# Altium project Gymbal.PrjPcb
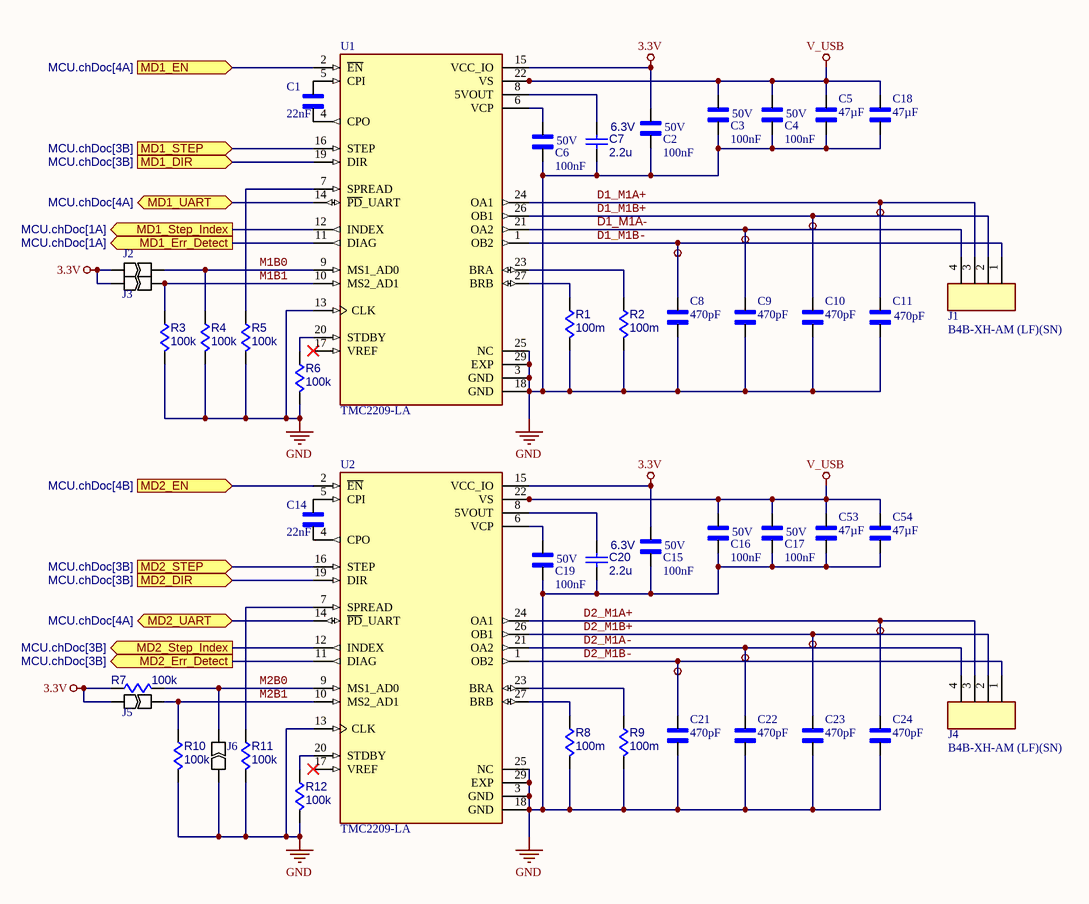
[diagram p0: Motordrivers.SchDoc]
Engineer: Gabriel Ohnstad
4 sheets, 119 parts. Net scope: flat (ports and power ports of the same name join across sheets).
Board file: PCB1.PcbDoc
Sheets:
  Motordrivers.SchDoc
  PowerRails.SchDoc
  Digital_IO.SchDoc
  MCU.chDoc.SchDoc

## Sheet Motordrivers.SchDoc
size A4; Revision: 0; SheetNumber: 1; SheetTotal: 4

### Parts
C1  value 22nF  [CAPC1005X55N]  (hidden comment: C0402C223K5REC7411)
C2  value 100nF  Voltage Rating: 50V  [CAPC1608X90N]  (hidden comment: GCM188L81H104KA57D)
C3  value 100nF  Voltage Rating: 50V  [CAPC1608X90N]  (hidden comment: GCM188L81H104KA57D)
C4  value 100nF  Voltage Rating: 50V  [CAPC1608X90N]  (hidden comment: GCM188L81H104KA57D)
C5  value 47µF  [CAPC3225X270N]  (hidden comment: GRM32ER61C476KE15L)
C6  value 100nF  Voltage Rating: 50V  [CAPC1608X90N]  (hidden comment: GCM188L81H104KA57D)
C7  value 2.2u  Voltage Rating: 6.3V  [CAPC0603(1608)100_L]  (hidden comment: Capacitors,2.2u,6.3V)
C8  value 470pF  [CAPC1608X90N]  (hidden comment: GRM1885C2A471JA01D)
C9  value 470pF  [CAPC1608X90N]  (hidden comment: GRM1885C2A471JA01D)
C10  value 470pF  [CAPC1608X90N]  (hidden comment: GRM1885C2A471JA01D)
C11  value 470pF  [CAPC1608X90N]  (hidden comment: GRM1885C2A471JA01D)
C14  value 22nF  [CAPC1005X55N]  (hidden comment: C0402C223K5REC7411)
C15  value 100nF  Voltage Rating: 50V  [CAPC1608X90N]  (hidden comment: GCM188L81H104KA57D)
C16  value 100nF  Voltage Rating: 50V  [CAPC1608X90N]  (hidden comment: GCM188L81H104KA57D)
C17  value 100nF  Voltage Rating: 50V  [CAPC1608X90N]  (hidden comment: GCM188L81H104KA57D)
C18  value 47µF  [CAPC3225X270N]  (hidden comment: GRM32ER61C476KE15L)
C19  value 100nF  Voltage Rating: 50V  [CAPC1608X90N]  (hidden comment: GCM188L81H104KA57D)
C20  value 2.2u  Voltage Rating: 6.3V  [CAPC0603(1608)100_L]  (hidden comment: Capacitors,2.2u,6.3V)
C21  value 470pF  [CAPC1608X90N]  (hidden comment: GRM1885C2A471JA01D)
C22  value 470pF  [CAPC1608X90N]  (hidden comment: GRM1885C2A471JA01D)
C23  value 470pF  [CAPC1608X90N]  (hidden comment: GRM1885C2A471JA01D)
C24  value 470pF  [CAPC1608X90N]  (hidden comment: GRM1885C2A471JA01D)
C53  value 47µF  [CAPC3225X270N]  (hidden comment: GRM32ER61C476KE15L)
C54  value 47µF  [CAPC3225X270N]  (hidden comment: GRM32ER61C476KE15L)
J1  B4B-XH-AM (LF)(SN)  [FP-B4B-XH-AM_LF_SN-MFG]
J2  JUMPER  [JUMPER]  (value not drawn)
J3  JUMPER  [JUMPER]  (value not drawn)
J4  B4B-XH-AM (LF)(SN)  [FP-B4B-XH-AM_LF_SN-MFG]
J5  JUMPER  [JUMPER]  (value not drawn)
J6  JUMPER  [JUMPER]  (value not drawn)
R1  value 100m  [RESC0402(1005)_L]  (hidden comment: Resistors,0402,1%,100m)
R2  value 100m  [RESC0402(1005)_L]  (hidden comment: Resistors,0402,1%,100m)
R3  value 100k  [RESC0402(1005)_L]  (hidden comment: Resistors,0402,100k)
R4  value 100k  [RESC0402(1005)_L]  (hidden comment: Resistors,0402,100k)
R5  value 100k  [RESC0402(1005)_L]  (hidden comment: Resistors,0402,100k)
R6  value 100k  [RESC0402(1005)_L]  (hidden comment: Resistors,0402,100k)
R7  value 100k  [RESC0402(1005)_L]  (hidden comment: Resistors,0402,100k)
R8  value 100m  [RESC0402(1005)_L]  (hidden comment: Resistors,0402,1%,100m)
R9  value 100m  [RESC0402(1005)_L]  (hidden comment: Resistors,0402,1%,100m)
R10  value 100k  [RESC0402(1005)_L]  (hidden comment: Resistors,0402,100k)
R11  value 100k  [RESC0402(1005)_L]  (hidden comment: Resistors,0402,100k)
R12  value 100k  [RESC0402(1005)_L]  (hidden comment: Resistors,0402,100k)
U1  TMC2209-LA  [QFN50P500X500X90-29N]
U2  TMC2209-LA  [QFN50P500X500X90-29N]

### Ports
MD1_DIR (in, see MCU.chDoc[3B]), MD1_EN (in, see MCU.chDoc[4A]), MD1_Err_Detect (out, see MCU.chDoc[1A]), MD1_STEP (in, see MCU.chDoc[3B]), MD1_Step_Index (out, see MCU.chDoc[1A]), MD1_UART (bidir, see MCU.chDoc[4A]), MD2_DIR (in, see MCU.chDoc[3B]), MD2_EN (in, see MCU.chDoc[4B]), MD2_Err_Detect (out, see MCU.chDoc[3B]), MD2_STEP (in, see MCU.chDoc[3B]), MD2_Step_Index (out, see MCU.chDoc[3B]), MD2_UART (bidir, see MCU.chDoc[4A])

### Nets
3.3V: C2.1 C15.1 J2.1 J3.1 J5.1 R7.1 U1.15(VCC_IO) U2.15(VCC_IO)
D1_M1A+: C11.2 J1.3 U1.24(OA1)
D1_M1A-: C9.2 J1.4 U1.21(OA2)
D1_M1B+: C10.2 J1.2 U1.26(OB1)
D1_M1B-: C8.2 J1.1 U1.1(OB2)
D2_M1A+: C24.2 J4.3 U2.24(OA1)
D2_M1A-: C22.2 J4.4 U2.21(OA2)
D2_M1B+: C23.2 J4.2 U2.26(OB1)
D2_M1B-: C21.2 J4.1 U2.1(OB2)
GND: C2.2 C3.2 C4.2 C5.2 C6.2 C7.2 C8.1 C9.1 C10.1 C11.1 C15.2 C16.2 C17.2 C18.2 C19.2 C20.2 C21.1 C22.1 C23.1 C24.1 C53.2 C54.2 J6.1 R1.2 R2.2 R3.2 R4.2 R5.2 R6.2 R8.2 R9.2 R10.2 R11.2 R12.2 U1.3(GND) U1.13(CLK) U1.18(GND) U1.25(NC) U1.29(EXP) U2.3(GND) U2.13(CLK) U2.18(GND) U2.25(NC) U2.29(EXP)
V_USB: C3.1 C4.1 C5.1 C16.1 C17.1 C18.1 C53.1 C54.1 U1.22(VS) U1.28(VS) U2.22(VS) U2.28(VS)
DRIVER_EN: U1.2(~{EN}) U2.2(~{EN}) ; port MD1_EN, port MD2_EN
M1B0: J2.2 R4.1 U1.9(MS1_AD0)
M1B1: J3.2 R3.1 U1.10(MS2_AD1)
M2B0: J6.2 R7.2 U2.9(MS1_AD0)
M2B1: J5.2 R10.1 U2.10(MS2_AD1)
MD1_DIR: U1.16(STEP) ; port MD1_STEP
MD1_ERR_Detect: U1.11(DIAG) ; port MD1_Err_Detect
MD1_STEP: U1.19(DIR) ; port MD1_DIR
MD1_STEP_Index: U1.12(INDEX) ; port MD1_Step_Index
MD2_DIR: U2.19(DIR) ; port MD2_DIR
MD2_ERR_Detect: U2.11(DIAG) ; port MD2_Err_Detect
MD2_STEP: U2.16(STEP) ; port MD2_STEP
MD2_STEP_Index: U2.12(INDEX) ; port MD2_Step_Index
MD_UART: U1.14(~{PD}_UART) U2.14(~{PD}_UART) ; port MD1_UART, port MD2_UART
NetC1_1: C1.1 U1.4(CPO)
NetC1_2: C1.2 U1.5(CPI)
NetC6_1: C6.1 U1.6(VCP)
NetC7_1: C7.1 U1.8(5VOUT)
NetC14_1: C14.1 U2.4(CPO)
NetC14_2: C14.2 U2.5(CPI)
NetC19_1: C19.1 U2.6(VCP)
NetC20_1: C20.1 U2.8(5VOUT)
NetR1_1: R1.1 U1.27(BRB)
NetR2_1: R2.1 U1.23(BRA)
NetR5_1: R5.1 U1.7(SPREAD)
NetR6_1: R6.1 U1.20(STDBY)
NetR8_1: R8.1 U2.27(BRB)
NetR9_1: R9.1 U2.23(BRA)
NetR11_1: R11.1 U2.7(SPREAD)
NetR12_1: R12.1 U2.20(STDBY)

Not connected (* = marked no-connect by the designer): U1 17(VREF)*; U2 17(VREF)*

### Notes on the sheet
- Title
- Engineer
- Size:
- Date:
- A4
- Number:
- Time:
- Revision:
- Sheet
- of
- File:

### Library data of the parts
C1 C14 = CMP-001-00084-1: 0.022 ÂµF Â±10% 50V Ceramic Capacitor X7R 0402 (1005 Metric); MF: KEMET; Case/Package: 1005 KEMET; Pins: 2; Component Type: Standard; Source: C0402C223K5REC7411.SchLib; SnapEDA_Link: https://www.snapeda.com/parts/C0402C223K5REC7411/KEMET/view-part/?ref=snap; MP: C0402C223K5REC7411; Design Item ID: C0402C223K5REC7411; Check_prices: https://www.snapeda.com/parts/C0402C223K5REC7411/KEMET/view-part/?ref=eda
C2-C4 C6 C15-C17 C19 = CMP-001-00085-1: SMD capacitor X8L(MURATA) with capacitance 0.10uF Tol.10%. Rated voltage 50Vdc 150C; MF: Murata Electronics; Pins: 2; Component Type: Standard; Check_prices: https://www.snapeda.com/parts/GCM188L81H104KA57D/Murata+Electronics+North+America/view-part/?ref=eda; Source: GCM188L81H104KA57D.SchLib; MP: GCM188L81H104KA57D; Design Item ID: GCM188L81H104KA57D; SnapEDA_Link: https://www.snapeda.com/parts/GCM188L81H104KA57D/Murata+Electronics+North+America/view-part/?ref=snap
C5 C18 C53 C54 = CMP-001-00087-1: SMD Capacitor X5R(EIA) with Capacitance: 47uF Tol. 10%. Rated Voltage: 16Vdc; MF: Murata Electronics; Case/Package: 3225 Murata; Pins: 2; Component Type: Standard; Source: GRM32ER61C476KE15L.SchLib; SnapEDA_Link: https://www.snapeda.com/parts/GRM32ER61C476KE15L/Murata+Electronics+North+America/view-part/?ref=snap; Design Item ID: GRM32ER61C476KE15L; MP: GRM32ER61C476KE15L; Check_prices: https://www.snapeda.com/parts/GRM32ER61C476KE15L/Murata+Electronics+North+America/view-part/?ref=eda
C7 C20 = Capacitors: Capacitor, Decoupling; Component Type: Capacitors
C8-C11 C21-C24 = CMP-001-00083-1: SMD Capacitor C0G(EIA) with Capacitance: 470pF Tol. 5%. Rated Voltage: 100Vdc; MF: Murata Electronics; Case/Package: 1608 Murata; Pins: 2; Component Type: Standard; Source: GRM1885C2A471JA01D.SchLib; MP: GRM1885C2A471JA01D; SnapEDA_Link: https://www.snapeda.com/parts/GRM1885C2A471JA01D/Murata+Electronics+North+America/view-part/?ref=snap; Check_prices: https://www.snapeda.com/parts/GRM1885C2A471JA01D/Murata+Electronics+North+America/view-part/?ref=eda; Design Item ID: GRM1885C2A471JA01D
J1 J4 = CMP-002-00073-1: CONN HEADER VERT 4POS 2.5MM / Connector Header Through Hole 4 position 0.098" (2.50mm); Number of Positions: 4; Connector Type: Male Pin; Pitch: 2.4892mm; Insulation Resistance: 1GΩ; Contact Resistance: 20mΩ; Ratings: TUV; Current Rating: 3A; Gender: Male; Voltage Rating: 250V; Termination: Solder; Orientation: Straight; Mounting Technology: Through Hole; Min Operating Temperature: -25°C; Terminal Pitch: 2.5mm; Housing Material: Polyamide; Max Operating Temperature: 85°C; Depth: 5.75mm; Lead Free: Lead Free; Length: 12.4mm; Harmonized Tariff Schedule (HTS) Code: 8536.69.40.40; Housing Color: White; RoHS: Compliant; Fastening Type: Detent; Color: Green; Introduction Date: 2010-11-30; Packaging: Box; Contact Material: Brass; Number of Contacts: 4; Export Control Classification Number (ECCN) Code: EAR99; Height: 7mm; Contact Plating: Tin; Insulation Color: White; Max Current Rating: 3A; Lifecycle Status: Production; Pins: 4; Max Voltage Rating (AC): 250V; Number of Rows: 1; REACH SVHC: Yes
J2 J3 J5 J6 = CMP-009-00061-10: Pins: 2
R1 R2 R8 R9 = Resistors: Resistor; Case/Package: 0402; Tolerance: 1%; Component Type: Resistors
R3-R7 R10-R12 = Resistors: Resistor, Bootstrap; Case/Package: 0402; Component Type: Resistors
U1 U2 = CMP-010-000001-7: Bipolar Motor Driver Power MOSFET Step/Direction, UART 28-QFN (5x5); MF: Maxim Integrated Products; MP: TMC2209-LA; Design Item ID: TMC2209-LA; Value: *; Pin Count: 29; Component Type: Standard; SnapEDA_Link: https://www.snapeda.com/parts/TMC2209-LA/Maxim+Integrated/view-part/?ref=snap; Package: None; Check_prices: https://www.snapeda.com/parts/TMC2209-LA/Maxim+Integrated/view-part/?ref=eda; Source: TMC2209-LA.SchLib

## Sheet PowerRails.SchDoc
size A4; SheetNumber: 2; SheetTotal: 4
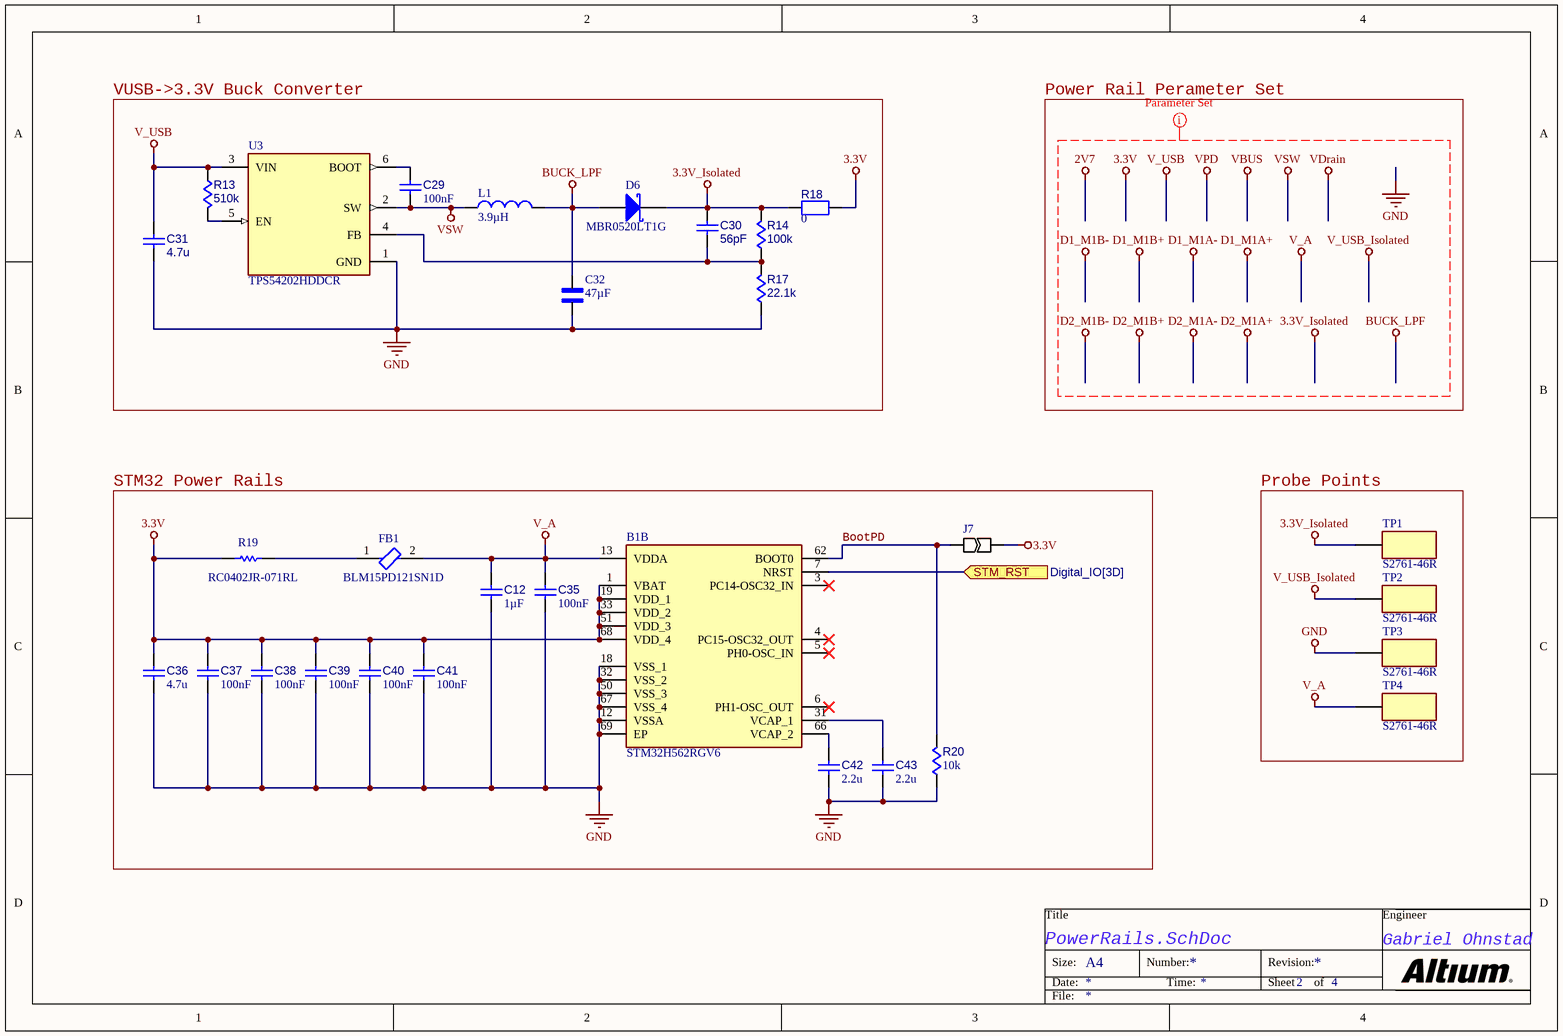
[diagram p1: PowerRails.SchDoc]

### Parts
B1  STM32H562RGV6  [QFN40P800X800X100-69N-D]  (part B of 2)
C12  value 1µF  [CAPC1608X94X35NL15T15]  (hidden comment: Capacitor 1 uF +/- 10% 16 V 0603)
C29  value 100nF  [CAPC0402(1005)60_L]  (hidden comment: Capacitor 100nF +/-20% 25V 0402)
C30  value 56pF  [CAPC0402(1005)60_L]  (hidden comment: Capacitors,ceramic,0402,5%,56pF)
C31  value 4.7u  [CAPC0805(2012)145_L]  (hidden comment: Capacitors,0805,4.7u)
C32  value 47µF  [CAPC3225X270N]  (hidden comment: GRM32ER61C476KE15L)
C35  value 100nF  [CAPC0402(1005)60_L]  (hidden comment: Capacitor 100nF +/-20% 25V 0402)
C36  value 4.7u  [CAPC0805(2012)145_L]  (hidden comment: Capacitors,0805,4.7u)
C37  value 100nF  [CAPC0402(1005)60_L]  (hidden comment: Capacitor 100nF +/-20% 25V 0402)
C38  value 100nF  [CAPC0402(1005)60_L]  (hidden comment: Capacitor 100nF +/-20% 25V 0402)
C39  value 100nF  [CAPC0402(1005)60_L]  (hidden comment: Capacitor 100nF +/-20% 25V 0402)
C40  value 100nF  [CAPC0402(1005)60_L]  (hidden comment: Capacitor 100nF +/-20% 25V 0402)
C41  value 100nF  [CAPC0402(1005)60_L]  (hidden comment: Capacitor 100nF +/-20% 25V 0402)
C42  value 2.2u  [CAPC0805(2012)145_L]  (hidden comment: Capacitors,0805,2.2u)
C43  value 2.2u  [CAPC0805(2012)145_L]  (hidden comment: Capacitors,0805,2.2u)
D6  MBR0520LT1G  [ONSC-SOD-123-2-425-04_V]
FB1  BLM15PD121SN1D  [FP-BLM15-0_05-IPC_B]
J7  JUMPER  [JUMPER]  (value not drawn)
L1  value 3.9µH  [SRR5018-3R9Y-Footprint-1]  (hidden comment: SRR5018-3R9Y)
R13  value 510k  [RESC0402(1005)_L]  (hidden comment: Resistors,0402,510k)
R14  value 100k  [RESC0402(1005)_L]  (hidden comment: Resistors,0402,100k)
R17  value 22.1k  [RESC0402(1005)_L]  (hidden comment: Resistors,0402,22.1k)
R18  value 0  [RESC0805(2012)_L]  (hidden comment: HCJ0805ZT0R00)
R19  RC0402JR-071RL  [RESC1005X40X25LL05T10]
R20  value 10k  [RESC0402(1005)_L]  (hidden comment: Resistors,0402,10k)
TP1  S2761-46R  [HARWIN_S2761-46R]
TP2  S2761-46R  [HARWIN_S2761-46R]
TP3  S2761-46R  [HARWIN_S2761-46R]
TP4  S2761-46R  [HARWIN_S2761-46R]
U3  TPS54202HDDCR  [FP-DDC0006A-IPC_C]

### Blocks framed on the sheet
VUSB->3.3V Buck Converter: C29-C32 D6 L1 R13 R14 R17 R18 U3
STM32 Power Rails: B1 C12 C35-C43 FB1 J7 R19 R20
Probe Points: TP1-TP4

### Ports
STM_RST (in, see Digital_IO[3D])

### Nets
3.3V: B1.1(VBAT) B1.19(VDD_1) B1.33(VDD_2) B1.51(VDD_3) B1.68(VDD_4) C36.2 C37.1 C38.1 C39.1 C40.1 C41.1 J7.2 R18.1 R19.1
3.3V_Isolated: C30.2 D6.2(K) R14.2 R18.2 TP1.1
BUCK_LPF: C32.1 D6.1(A) L1.2
GND: B1.12(VSSA) B1.18(VSS_1) B1.32(VSS_2) B1.50(VSS_3) B1.67(VSS_4) B1.69(EP) C12.1 C31.1 C32.2 C35.2 C36.1 C37.2 C38.2 C39.2 C40.2 C41.2 C42.1 C43.1 R17.1 R20.1 TP3.1 U3.1(GND)
V_A: B1.13(VDDA) C12.2 C35.1 FB1.2 TP4.1
V_USB: C31.2 R13.1 U3.3(VIN)
V_USB_Isolated: TP2.1
VSW: C29.1 L1.1 U3.2(SW)
BootPD: B1.62(BOOT0) J7.1 R20.2
NetB1_7: B1.7(NRST) ; port STM_RST
NetB1_31: B1.31(VCAP_1) C43.2
NetB1_66: B1.66(VCAP_2) C42.2
NetC29_2: C29.2 U3.6(BOOT)
NetC30_1: C30.1 R14.1 R17.2 U3.4(FB)
NetFB1_1: FB1.1 R19.2
NetR13_2: R13.2 U3.5(EN)

Not connected (* = marked no-connect by the designer): B1 3(PC14-OSC32_IN)* 4(PC15-OSC32_OUT)* 5(PH0-OSC_IN)* 6(PH1-OSC_OUT)*

### Notes on the sheet
- Power Rail Perameter Set
- Title
- Engineer
- Size:
- Date:
- A4
- Number:
- Time:
- Revision:
- Sheet
- of
- File:

### Library data of the parts
B1 = CMP-004-000001-1: MCU 32-bit ARM Cortex M33 RISC 1MB Flash 1.8V/2.5V/3.3V 68-Pin VFQFPN EP Tray; Manufacturer_Name: STMicroelectronics; Geometry.Height: 1mm; Core Architecture: ARM Cortex-M33; Datasheet Link: https://www.st.com/resource/en/datasheet/stm32h562ag.pdf; Mouser Price/Stock: https://www.mouser.co.uk/ProductDetail/STMicroelectronics/STM32H563RGV6?qs=Jm2GQyTW%2FbjkEO3Um3%252BxKg%3D%3D; Mouser Part Number: 511-STM32H563RGV6; Design Item ID: STM32H563RGV6; Manufacturer_Part_Number: STM32H563RGV6; Source: STM32H563RGV6.SchLib; Memory Format: FLASH; REACH SVHC: Yes; Lifecycle Status: Production; Pins: 68; China RoHS: Compliant; RoHS: Compliant
C12 = CMP-001-00003-9: Chip Capacitor, 1 uF, +/- 10%, 16 V, 0603 (1608 Metric); Voltage Rating: 16V; Capacitor Type: Ceramic; RoHS Compliant: True; Case/Package: 0603; Tolerance: 10%; Mounting Technology: SM; Pins: 2; Min Operating Temperature: -55°C; Max Operating Temperature: 125°C
C29 C35 C37-C41 = CMP-001-00065-7: Chip Capacitor, 100nF +/-20%, 25V, 0402, Thickness 0.6 mm; Tolerance: 10%; Mounting Technology: SMT; Case/Package: 0402; Pins: 2; Min Operating Temperature: -55°C; Max Operating Temperature: 85°C; Voltage Rating: 25V
C30 = Capacitors: Capacitor, Filter; Case/Package: 0402; Capacitor Type: ceramic; Tolerance: 5%; Component Type: Capacitors
C31 C36 = Capacitors: Capacitor, Decoupling; Case/Package: 0805; Component Type: Capacitors
C32 = CMP-001-00087-1: as C5 on sheet Motordrivers; Case/Package: 3225 Murata; Pins: 2; Component Type: Standard; Source: GRM32ER61C476KE15L.SchLib; SnapEDA_Link: https://www.snapeda.com/parts/GRM32ER61C476KE15L/Murata+Electronics+North+America/view-part/?ref=snap; Design Item ID: GRM32ER61C476KE15L; MP: GRM32ER61C476KE15L; Check_prices: https://www.snapeda.com/parts/GRM32ER61C476KE15L/Murata+Electronics+North+America/view-part/?ref=eda
C42 C43 = Capacitors: Capacitor, Charge Pump; Case/Package: 0805; Component Type: Capacitors
D6 = CMP-004-00003-2: Schottky Power Rectifier, 20 V, 5.5 A, -65 to 125 degC, 2-Pin SMD, RoHS, Tape and Reel; Manufacturer: ON Semiconductor; Forward Current: 500mA; Peak Reverse Current: 250uA; Elements: 1; Forward Voltage: 385mV; Max Surge Current: 5.5A; Max Operating Temperature: 125°C; Min Operating Temperature: -65°C; Mounting Technology: SM; Datasheet URL: http://www.onsemi.cn/pub_link/Collateral/MBR0520LT1-D.PDF; RoHS Compliant: True; Pins: 2; Package Quantity: 3000; Case/Package: SOD; Package Reference: SOD-123-2-425-04; Package Description: 2-Pin Surface Mount Device, Body 2.69 x 1.6 mm; Packaging: TapeandReel; Manufacturer URL: http://www.onsemi.com/; Datasheet Version: Rev. 6, 01/2012
FB1 = CMP-0686-00281-4: Chip Ferrite Bead, 0402, 120Ω @ 100MHz, 0.09Ω, 25%, 1.3A; Impedance: 120R; Material: Steel; Number of Lines: 1; DC Resistance (DCR): 90mR; Number of Pins: 2; Military Standard: Not; Width: 0.5mm; Depth: 0.55mm; Lead Free: Lead Free; Test Frequency: 100MHz; Case Code (Metric): 1005; Case Code (Imperial): 0402; Current Rating: 1.3A; Package Quantity: 1; Height: 0.5mm; Radiation Hardening: No; Tolerance: 25%; Max DC Current: 1.3A; Packaging: Tape and Reel; REACH SVHC: No SVHC; Case/Package: 0402; Min Operating Temperature: -55°C; Max Current Rating: 1.3A; Length: 1mm; Number of Circuits: 1; Core Material: Ferrite; Max Operating Temperature: 125°C; Termination: SMD/SMT; DC Current: 1.3A
J7 = CMP-009-00061-10: Pins: 2
L1 = CMP-006-00022-2: Inductor Power Shielded Wirewound 3.9uH 30% 100KHz 8Q-Factor Ferrite 2A 0.055Ohm DCR T/R; DC Resistance (DCR): 55mΩ; Max Current Rating: 2.1A; Self Resonant Frequency: 64MHz; Q Factor: 8; Number of Circuits: 1; Harmonized Tariff Schedule (HTS) Code: 8504.50.80.00; Schedule B: 8504500000, 8504500000; Case Code (Imperial): 2323; Lifecycle Status: Production; Number of Terminals: 2; Height - Seated (Max): 1.8034mm; Termination: SMD/SMT; RoHS: Compliant; Depth: 6.1mm; Max DC Current: 2A; Tolerance: 30%; Min Operating Temperature: -40°C; Country of Origin: Mainland China; Export Control Classification Number (ECCN) Code: EAR99; Composition: Wirewound; Max Operating Temperature: 125°C; Military Standard: Not; Packaging: Tape and Reel; Test Frequency: 100kHz; Case Code (Metric): 5858; Introduction Date: 2007-08-29; Width: 5.8mm; Core Material: Ferrite; Shielding: Shielded; DC Current: 2A; Current Rating: 2A; Mounting Technology: Surface Mount; China RoHS: Compliant; Case/Package: 2323; Saturation Current: 2.1A; REACH SVHC: Yes; Length: 5.8mm; Height: 1.8mm
R13 R20 = Resistors: Resistor, Bootstrap; Case/Package: 0402; Component Type: Resistors
R14 R17 = Resistors: Resistor; Case/Package: 0402; Component Type: Resistors
R18 = CMP-009-00179-2: HCJ Series 0805 Jumper Surface Mount Chip Resistor; Manufacturer Package Identifier: 0805 (2012 metric); Power Rating: 500mW; DNP: TRUE; Mounting Technology: Surface Mount; Case/Package: 0805; Min Operating Temperature: -55°C; Max Operating Temperature: 155°C; Number of Terminals: 2; Export Control Classification Number (ECCN) Code: EAR99; Ratings: AEC-Q200; Radiation Hardening: No; Width: 1.2mm; Number of Terminations: 2; Length: 2mm; REACH SVHC: Yes; Harmonized Tariff Schedule (HTS) Code: 8533.21.00.30; Introduction Date: 2013-09-03; Termination: Wraparound; Lead Free: Lead Free; Packaging: Cut Tape (CT); Case Code (Metric): 2012; RoHS: Compliant; Country of Origin: Taiwan; Lifecycle Status: Production; Schedule B: 8533210045, 8533210045; Case Code (Imperial): 0805; Height: 650µm; Composition: Metal Strip
R19 = CMP-2002-07953-1: Manufacturer: Yageo / Phycomp; Part Number: RC0402JR-071RL
TP1-TP4 = CMP-028-000000-3: MF: {'manufacturer': u'Harwin Inc.'}; Availability: Unavailable; Design Item ID: S2761-46R; MP: S2761-46R; Price: None; Pin Count: 1; Package: None; Component Type: Standard; Source: S2761-46R.SchLib; Value: *
U3 = CMP-019-00052-1: 4.5V to 28V Input, 2A Output, Synchronous Step-Down Voltage Converter 6-SOT-23-THIN -40 to 125; Manufacturer Lifecycle Status: ACTIVE; Quiescent Current: 40µA; Max Junction Temperature (Tj): 125°C; Topology: Buck; Nominal Supply Current: 45µA; Max Duty Cycle: 100%; Number of Outputs: 1; Switching Frequency: 500kHz; Max Supply Voltage: 28V; Length: 2.9mm; Lifecycle Status: Production; Max Operating Temperature: 125°C; Output Current: 2A; Thickness: 870µm; Pins: 6; RoHS: Compliant; Height: 1.1mm; Min Operating Temperature: -40°C; Width: 1.6mm; Lead Free: Lead Free; Min Supply Voltage: 4.5V; Schedule B: 8542390000, 8542390000

## Sheet Digital_IO.SchDoc
size A4; SheetNumber: 3; SheetTotal: 4
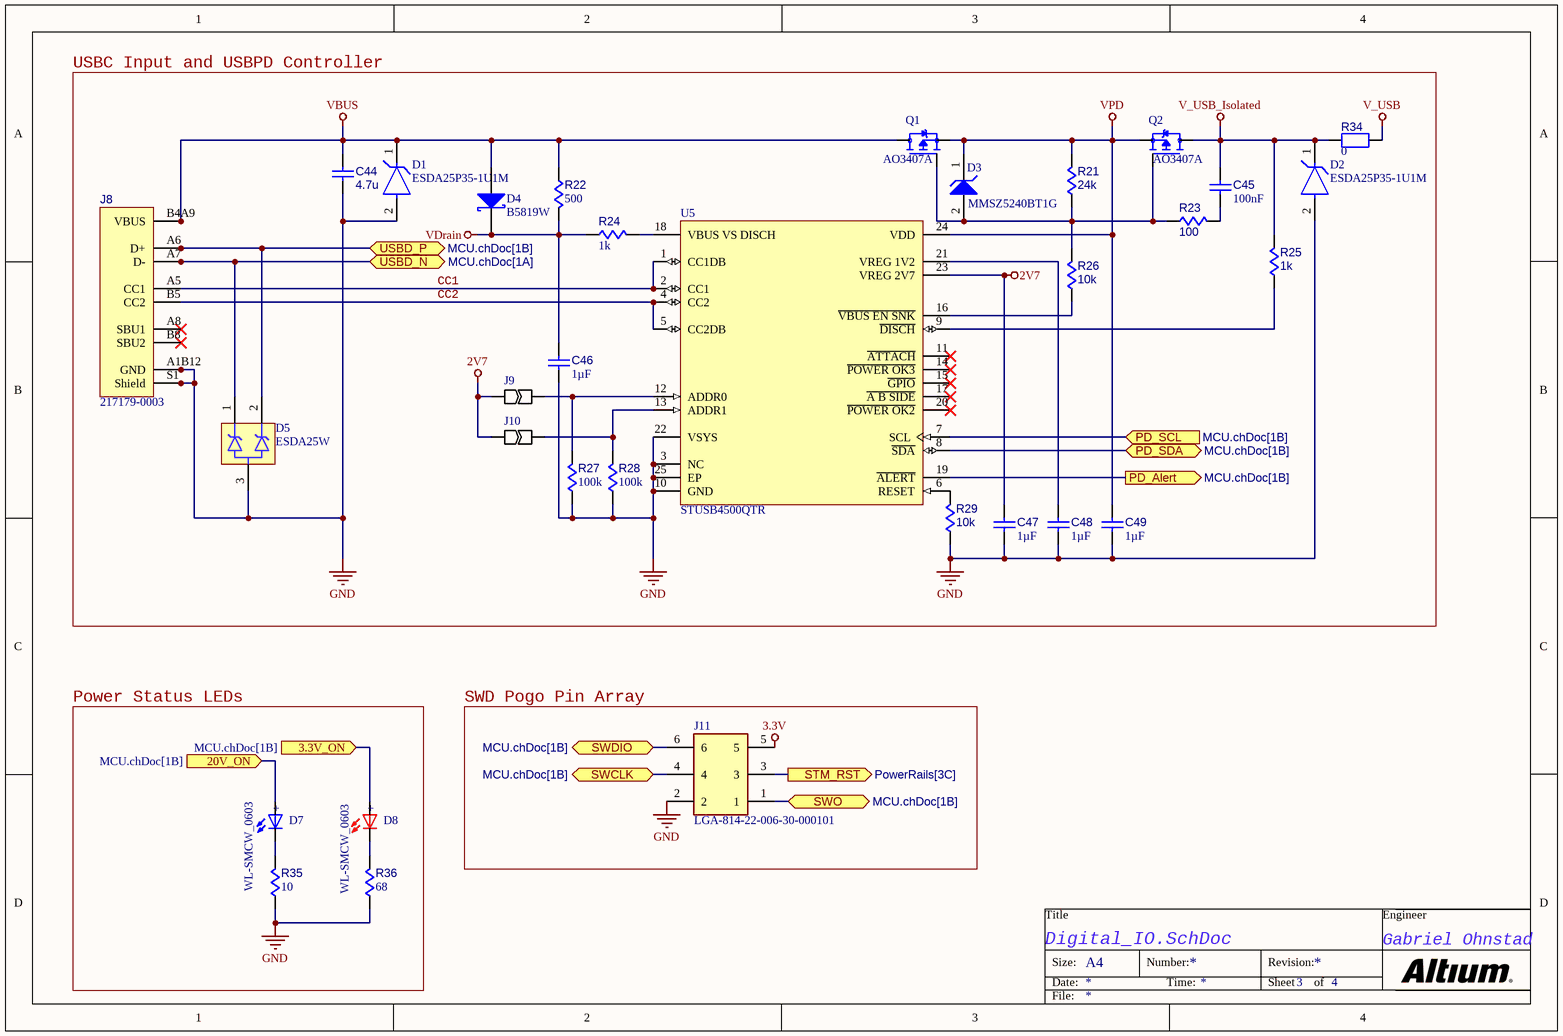
[diagram p2: Digital_IO.SchDoc]

### Parts
C44  value 4.7u  [CAPC0805(2012)145_L]  (hidden comment: Capacitors,0805,4.7u,50V)
C45  value 100nF  [CAPC0402(1005)60_L]  (hidden comment: Capacitor 100nF +/-20% 25V 0402)
C46  value 1µF  [CAPC2013X145X50ML20T25]  (hidden comment: Capacitor 1 uF +/- 10% 25 V 0805)
C47  value 1µF  [CAPC0402(1005)60_L]  (hidden comment: Capacitor 1µF +/-20% 10V 0402)
C48  value 1µF  [CAPC0402(1005)60_L]  (hidden comment: Capacitor 1µF +/-20% 10V 0402)
C49  value 1µF  [CAPC2013X145X50ML20T25]  (hidden comment: Capacitor 1 uF +/- 10% 25 V 0805)
D1  ESDA25P35-1U1M  [FP-QFN_1610-MFG]
D2  ESDA25P35-1U1M  [FP-QFN_1610-MFG]
D3  MMSZ5240BT1G  [ONSC-SOD-123-2-425-04_V]
D4  B5819W  [MCC-SOD123_V]
D5  ESDA25W  [FP-SOT323-3L-IPC_C]
D7  WL-SMCW_0603  [WL-SMCW_0603]
D8  WL-SMCW_0603  [WL-SMCW_0603]
J8  217179-0003  [217179-0003-Footprint-1]
J9  JUMPER  [JUMPER]  (value not drawn)
J10  JUMPER  [JUMPER]  (value not drawn)
J11  LGA-814-22-006-30-000101  [Alignment-8142200630000101]
Q1  AO3407A  [SOT95P280X125-3N]
Q2  AO3407A  [SOT95P280X125-3N]
R21  value 24k  [RESC0402(1005)_L]  (hidden comment: Resistors,0402,24k)
R22  value 500  [RESC0603(1608)_L]  (hidden comment: Resistors,0603,500)
R23  value 100  [RESC0402(1005)_L]  (hidden comment: Resistors,0402,100)
R24  value 1k  [RESC0603(1608)_L]  (hidden comment: Resistors,0603,1k)
R25  value 1k  [RESC0402(1005)_L]  (hidden comment: Resistors,0402,1k)
R26  value 10k  [RESC0402(1005)_L]  (hidden comment: Resistors,0402,10k)
R27  value 100k  [RESC0402(1005)_L]  (hidden comment: Resistors,0402,100k)
R28  value 100k  [RESC0402(1005)_L]  (hidden comment: Resistors,0402,100k)
R29  value 10k  [RESC0402(1005)_L]  (hidden comment: Resistors,0402,10k)
R34  value 0  [RESC0805(2012)_L]  (hidden comment: HCJ0805ZT0R00)
R35  value 10  [RESC0402(1005)_L]  (hidden comment: Resistors,0402,10)
R36  value 68  [RESC0402(1005)_L]  (hidden comment: Resistors,0402,68)
U5  STUSB4500QTR  [FP-QFN-24-EP_4x4-MFG]

### Blocks framed on the sheet
USBC Input and USBPD Controller: C44-C49 D1-D5 J8-J10 Q1 Q2 R21-R29 R34 U5
Power Status LEDs: D7 D8 R35 R36
SWD Pogo Pin Array: J11

### Ports
3.3V_ON (in, see MCU.chDoc[1B]), 20V_ON (in, see MCU.chDoc[1B]), PD_Alert (out, see MCU.chDoc[1B]), PD_SCL (in, see MCU.chDoc[1B]), PD_SDA (bidir, see MCU.chDoc[1B]), STM_RST (out, see PowerRails[3C]), SWCLK (bidir, see MCU.chDoc[1B]), SWDIO (bidir, see MCU.chDoc[1B]), SWO (bidir, see MCU.chDoc[1B]), USBD_N (bidir, see MCU.chDoc[1A]), USBD_P (bidir, see MCU.chDoc[1B])

### Nets
2V7: C47.2 J9.1 J10.1 U5.23(VREG_2V7)
3.3V: J11.5
GND: C44.1 C46.1 C47.1 C48.1 C49.1 D1.2(A) D2.2(A) D5.3(COMMON_ANODE) J8.A1B12(GND) J8.B1A12(GND) J8.S1(Shield) J8.S2(Shield) J8.S3(Shield) J8.S4(Shield) J11.2 R27.1 R28.1 R29.1 R35.1 R36.1 U5.3(NC) U5.10(GND) U5.22(VSYS) U5.25(EP)
V_USB: R34.1
V_USB_Isolated: C45.1 D2.1(C) Q2.3(D) R25.2 R34.2
VBUS: C44.2 D1.1(C) D4.1(A) J8.A4B9(VBUS) J8.B4A9(VBUS) Q1.3(D) R22.2
VDrain: C46.2 D4.2(K) R22.1 R24.2
VPD: C49.2 D3.1(K) Q1.2(S) Q2.2(S) R21.2 U5.24(VDD)
3.3V_ON: D8.2(POS) ; port 3.3V_ON
20V_ON: D7.2(POS) ; port 20V_ON
CC1: J8.A5(CC1) U5.1(CC1DB) U5.2(CC1)
CC2: J8.B5(CC2) U5.4(CC2) U5.5(CC2DB)
PD_Alert: U5.19(~{ALERT}) ; port PD_Alert
PD_SCL: U5.7(SCL) ; port PD_SCL
PD_SDA: U5.8(~{SDA}) ; port PD_SDA
SWCLK: J11.4 ; port SWCLK
SWDIO: J11.6 ; port SWDIO
SWO: J11.1 ; port SWO
USBD_N: D5.1(1_CATHODE) J8.A7(D-) J8.B7(D-) ; port USBD_N
USBD_P: D5.2(2_CATHODE) J8.A6(D+) J8.B6(D+) ; port USBD_P
NetB1_7: J11.3 ; port STM_RST
NetC45_2: C45.2 R23.2
NetC48_2: C48.2 U5.21(VREG_1V2)
NetD3_2: D3.2(A) Q1.1(G) Q2.1(G) R21.1 R23.1 R26.2
NetD7_1: D7.1(NEG) R35.2
NetD8_1: D8.1(NEG) R36.2
NetJ9_2: J9.2 R27.2 U5.12(ADDR0)
NetJ10_2: J10.2 R28.2 U5.13(ADDR1)
NetR24_1: R24.1 U5.18(VBUS_VS_DISCH)
NetR25_1: R25.1 U5.9(~{DISCH})
NetR26_1: R26.1 U5.16(~{VBUS_EN_SNK})
NetR29_2: R29.2 U5.6(RESET)

Not connected (* = marked no-connect by the designer): J8 A8(SBU1)* B8(SBU2)*; U5 11(~{ATTACH})* 14(~{POWER_OK3})* 15(~{GPIO})* 17(~{A_B_SIDE})* 20(~{POWER_OK2})*

### Notes on the sheet
- Title
- Engineer
- Size:
- Date:
- A4
- Number:
- Time:
- Revision:
- Sheet
- of
- File:
- (in symbol CMP-004-00035-2) +
- (in symbol CMP-004-00036-3) +

### Library data of the parts
C44 = Capacitors: Capacitor; Case/Package: 0805; Voltage Rating: 50V; Component Type: Capacitors
C45 = CMP-001-00065-7: as C29 on sheet PowerRails; Mounting Technology: SMT; Case/Package: 0402; Pins: 2; Min Operating Temperature: -55°C; Max Operating Temperature: 85°C; Voltage Rating: 25V
C46 C49 = CMP-001-00010-9: Chip Capacitor, 1 uF, +/-10%, 25 V, 0805 (2012 Metric); Capacitor Type: Ceramic; Voltage Rating: 25V; Mounting Technology: SM; Case/Package: 0805; Pins: 2; RoHS Compliant: True; Min Operating Temperature: -55°C; Max Operating Temperature: 125°C; Tolerance: 10%
C47 C48 = CMP-001-00063-6: Chip Capacitor, 1µF +/-20%, 10V, 0402, Thickness 0.6 mm; Tolerance: 10%; Pins: 2; Mounting Technology: SMT; Case/Package: 0402; Max Operating Temperature: 85°C; Voltage Rating: 10V; Min Operating Temperature: -55°C
D1 D2 = CMP-12225-000030-1: TVS DIODE 22V 41V 1610; Manufacturer: STMicroelectronics; Clamping Voltage: 39V; Breakdown Voltage: 23.3V; Max Junction Temp: +150°C; Peak Pulse Current: 35A; Number Of Channels: 1; Peak Pulse Power: 1400W; Standoff Height: 0.02mm; Direction: Unidirectional; ComponentLink2URL: https://www.st.com/resource/en/datasheet/esda25p35-1u1m.pdf; Height: 0.6mm; Device Class L2: TVS Diodes; Temperature: -55°C to +150°C; Category: Diode; Temperature Range Low: -55°C; Digikey Description: TVS DIODE 22V 41V 1610; Reverse Standoff Voltage: 22V; Lead Free: Yes; Automotive: No; RoHS: TRUE; Manufacturer Part Number: ESDA25P35-1U1M; Temperature Range High: +150°C; Package: QFN_1610; Device Class L1: Circuit Protection; Device Class L3: unset; ComponentLink2Description: Datasheet; Octopart: https://octopart.com/esda25p35-1u1m-stmicroelectronics-75302699; Mouser Description: ESDA Series 1400 W 25 V Uni-Directional Surface Mount TVS Diode - QFN-1610
D3 = CMP-1060-00549-1: Zener Voltage Regulator, 500 mW, 2-Pin SOD-123, Pb-Free, Tape and Reel; Manufacturer: On Semiconductor; P Max (W): 0.5; VZ Typ (V): 10; PackageVersion: Rev. G, 10/2009; ComponentLink2Description: Datasheet; RoHS: Pb-Free; ComponentLink2URL: http://www.onsemi.com/pub_link/Collateral/MMSZ5221BT1-D.PDF; PackageReference: SOD-123-2-425-04; ComponentLink1URL: http://www.onsemi.com/; ComponentLink3Description: Package Specification; ComponentLink1Description: Manufacturer URL; Packing: Tape and Reel; Mounting Technology: Surface Mount; ComponentLink3URL: http://www.onsemi.com/pub_link/Collateral/425-04.PDF; PackageDescription: 2-Pin SOD, Body 1.6 x 2.69 mm; PartNumber: MMSZ5240BT1G; DatasheetVersion: Rev. 12
D4 = CMP-004-00005-2: Schottky Barrier Rectifier, 40 V, 1 A, -65 to 125 degC, 2-Pin SOD123, RoHS, Tape and Reel; Manufacturer: Micro Commercial Components; Datasheet Version: Rev. B, 01/2013; RoHS Compliant: Unknown; Manufacturer URL: http://www.mccsemi.com/; Package URL: http://www.mccsemi.com/up_pdf/1N4448W(SOD-123).pdf; Case/Package: SOD123; Mounting Technology: SM; Datasheet URL: http://www.mccsemi.com/up_pdf/B5817W-B5819W(SOD-123).pdf; Package Description: 2-Pin Small Outline Diode, Body 2.7 x 1.6 mm, Height 1.35 mm; Package Reference: SOD123
D5 = CMP-004-00032-1: 25V 400W 25V 24V SOT-323-3L ESD and Surge Protection (TVS/ESD) ROHS; ESD Protection: Yes; Max Reverse Leakage Current: 1µA; Number of Channels: 2; Direction: Unidirectional; Breakdown Voltage: 27.5V; Max Junction Temperature (Tj): 125°C; Element Configuration: Common Anode; Power Rating: 150W; Forward Voltage: 1.2V; Max Breakdown Voltage: 30V; Power Line Protection: No; Value: 65pF; Test Current: 1mA; Length: 2mm; Lead Free: Lead Free; Reverse Standoff Voltage: 24V; Peak Pulse Power: 400W; Harmonized Tariff Schedule (HTS) Code: 8541.10.00.50; Height: 1.1mm; Schedule B: 8536300000, 8536300000; Min Breakdown Voltage: 25V; Width: 1.25mm; Termination: SMD/SMT; Max Power Dissipation: 400W; Working Voltage: 24V; Number of Elements: 2; Leakage Current: 1µA; Export Control Classification Number (ECCN) Code: EAR99; Pins: 3; Introduction Date: 1980-01-04; Case/Package: SOT-323; Radiation Hardening: No; Reverse Breakdown Voltage: 25V; Mounting Technology: Surface Mount; Operating Supply Voltage: 1.2V; Number of Terminals: 3; REACH SVHC: Yes; Polarity: Unidirectional; Depth: 1.25mm; Number of Unidirectional Channels: 2; Lifecycle Status: Production; RoHS: Compliant; Country of Origin: Mainland China; Peak Reverse Current: 1µA; Composition: Zener; Max Operating Temperature: 125°C; China RoHS: Compliant; Min Operating Temperature: -40°C; Voltage Rating (DC): 25V
D7 = CMP-004-00035-2: 0603, Blue Typ.(@20mA): 470nm, 145mcd, 3.2V, 140Â° InGaN; MP: 150060BS75000; MF: Wurth Electronics; Check_prices: https://www.snapeda.com/parts/150060BS75000/Wurth+Electronics/view-part/?ref=eda; Component Type: Standard; Case/Package: 0603 Wurth Electronics; Design Item ID: WL-SMCW_0603; Pins: 2; Source: WL-SMCW_0603.SchLib; SnapEDA_Link: https://www.snapeda.com/parts/150060BS75000/Wurth+Electronics/view-part/?ref=snap; Value: *
D8 = CMP-004-00036-3: 0603, Red Typ.(@20mA): 625nm, 250mcd, 2.0V, 140Â° AlInGaP; MP: 150060RS75000; MF: Wurth Electronics; Pins: 2; Source: WL-SMCW_0603.SchLib; SnapEDA_Link: https://www.snapeda.com/parts/150060RS75000/Wurth+Electronics/view-part/?ref=snap; Case/Package: 0603 WÃ¼rth Elektronik; Component Type: Standard; Design Item ID: WL-SMCW_0603; Check_prices: https://www.snapeda.com/parts/150060RS75000/Wurth+Electronics/view-part/?ref=eda; Value: *
J8 = CMP-002-00084-5: Conn USB Type C RCP 16 POS 0.5mm Solder RA SMD 16 Terminal 1 Port USB T/R; Manufacturer: Molex; Connector Type: USBC; Gender: Receptacle; Max Current Rating: 5A; Case/Package: None; RoHS: Compliant; Lifecycle Status: Production; Value: *; Component Type: Standard
J9 J10 = CMP-009-00061-10: Pins: 2
J11 = CMP-002-00083-5: MILL MAX - 814-22-006-30-000101 - CONNECTOR, HEADER, 2.54MM, 6POS, SMT; Manufacturer_Name: Mill-Max; Geometry.Height: 6.48mm; Mouser Part Number: 575-8142200630000101; Design Item ID: 814-22-006-30-000101; Manufacturer_Part_Number: 814-22-006-30-000101; Datasheet Link: https://www.mill-max.com/products/datasheet/sockets/814-22-006-30-000101; Source: 814-22-006-30-000101.SchLib; Mouser Price/Stock: https://www.mouser.com/Search/Refine.aspx?Keyword=575-8142200630000101; Arrow Part Number: 814-22-006-30-000101; Arrow Price/Stock: https://www.arrow.com/en/products/814-22-006-30-000101/mill-max
Q1 Q2 = CMP-012-000000-1: P-Channel 30 V 4.3A (Ta) 1.4W (Ta) Surface Mount SOT-23-3; MF: Alpha &; Source: AO3407A.SchLib; SnapEDA_Link: https://www.snapeda.com/parts/AO3407A/Alpha/view-part/?ref=snap; Component Type: Standard; Pin Count: 3; Value: *; MP: AO3407A; Design Item ID: AO3407A; Check_prices: https://www.snapeda.com/parts/AO3407A/Alpha/view-part/?ref=eda; Package: SOT-23 Alpha &amp; Omega Semiconductor
R21-R26 = Resistors: Resistor; Component Type: Resistors
  R21 R23 R25 R26: Case/Package: 0402
  R22 R24: Case/Package: 0603
R27-R29 R35 R36 = Resistors: Resistor, Bootstrap; Case/Package: 0402; Component Type: Resistors
R34 = CMP-009-00179-2: as R18 on sheet PowerRails; Mounting Technology: Surface Mount; Case/Package: 0805; Min Operating Temperature: -55°C; Max Operating Temperature: 155°C; Number of Terminals: 2; Export Control Classification Number (ECCN) Code: EAR99; Ratings: AEC-Q200; Radiation Hardening: No; Width: 1.2mm; Number of Terminations: 2; Length: 2mm; REACH SVHC: Yes; Harmonized Tariff Schedule (HTS) Code: 8533.21.00.30; Introduction Date: 2013-09-03; Termination: Wraparound; Lead Free: Lead Free; Packaging: Cut Tape (CT); Case Code (Metric): 2012; RoHS: Compliant; Country of Origin: Taiwan; Lifecycle Status: Production; Schedule B: 8533210045, 8533210045; Case Code (Imperial): 0805; Height: 650µm; Composition: Metal Strip
U5 = CMP-015-00008-2: Super Speed USB Controller USB 1.2/USB 2.0 5V/9V/12V/15V/18V T/R 24-Pin QFN EP; Max Supply Voltage: 22V; Number of Ports: 1; USB Standard: USB 2.0; Nominal Supply Voltage (DC): 5V; Max Junction Temperature (Tj): 145°C; Interface: I2C, USB; Min Supply Voltage: 4.1V; Number of Circuits: 1; Introduction Date: 2018-04-09; Harmonized Tariff Schedule (HTS) Code: 8542.39.00.60; Height: 1mm; Height - Seated (Max): 1mm; Lifecycle Status: Production; Width: 4mm; Schedule B: 8542390000, 8542390000; Number of Channels: 1; RoHS: Compliant; Export Control Classification Number (ECCN) Code: EAR99; Length: 4mm; Country of Origin: Mainland China; Number of Terminals: 26; Terminal Pitch: 500µm; REACH SVHC: Yes; Max Operating Temperature: 105°C; Min Operating Temperature: -40°C; China RoHS: Compliant; Ambient Temperature Range High: 105°C

## Sheet MCU.chDoc.SchDoc
size A4; Revision: 0; SheetNumber: 4; SheetTotal: 4
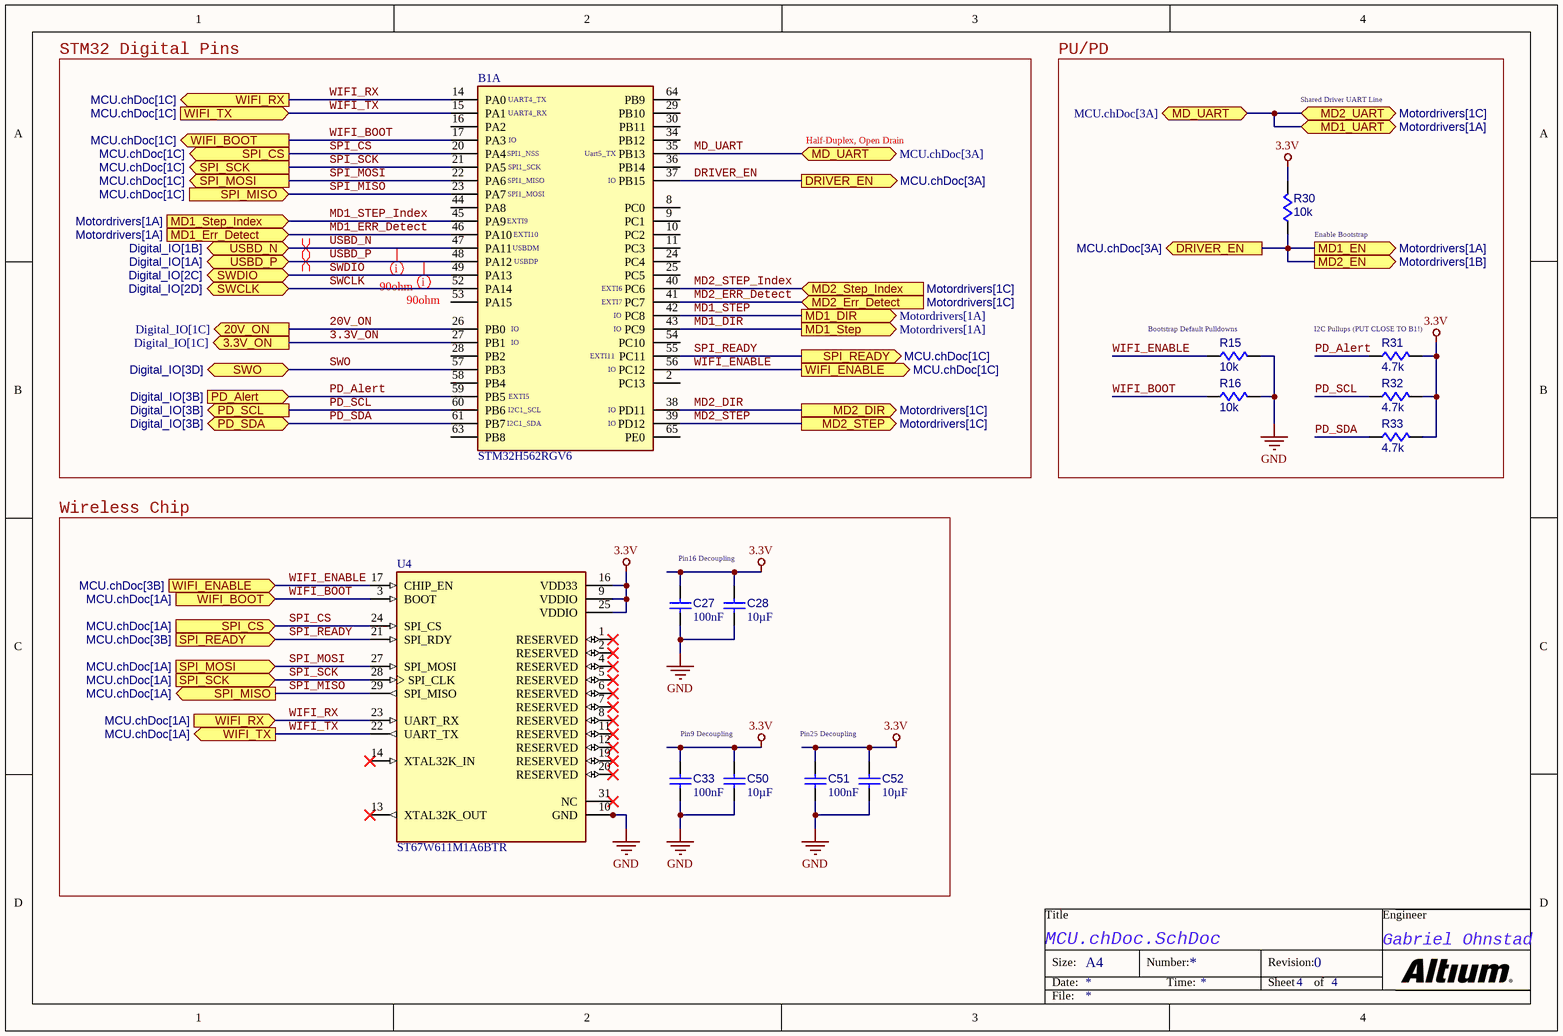
[diagram p3: MCU.chDoc.SchDoc]

### Parts
B1  STM32H562RGV6  [QFN40P800X800X100-69N-D]  (part A of 2)
C27  value 100nF  [CAPC0402(1005)60_L]  (hidden comment: Capacitor 100nF +/-20% 25V 0402)
C28  value 10µF  [CAPC2013X135X45NL10T25]  (hidden comment: Capacitor 10 uF +/- 10% 16 V 0805)
C33  value 100nF  [CAPC0402(1005)60_L]  (hidden comment: Capacitor 100nF +/-20% 25V 0402)
C50  value 10µF  [CAPC2013X135X45NL10T25]  (hidden comment: Capacitor 10 uF +/- 10% 16 V 0805)
C51  value 100nF  [CAPC0402(1005)60_L]  (hidden comment: Capacitor 100nF +/-20% 25V 0402)
C52  value 10µF  [CAPC2013X135X45NL10T25]  (hidden comment: Capacitor 10 uF +/- 10% 16 V 0805)
R15  value 10k  [RESC0402(1005)_L]  (hidden comment: Resistors,0402,10k)
R16  value 10k  [RESC0402(1005)_L]  (hidden comment: Resistors,0402,10k)
R30  value 10k  [RESC0402(1005)_L]  (hidden comment: Resistors,0402,10k)
R31  value 4.7k  [RESC0402(1005)_L]  (hidden comment: Resistors,0402,4.7k)
R32  value 4.7k  [RESC0402(1005)_L]  (hidden comment: Resistors,0402,4.7k)
R33  value 4.7k  [RESC0402(1005)_L]  (hidden comment: Resistors,0402,4.7k)
U4  ST67W611M1A6BTR  [MODULE_ST67W611M1A6BTR]

### Blocks framed on the sheet
STM32 Digital Pins: B1
PU/PD: R15 R16 R30-R33
Wireless Chip: C27 C28 C33 C50-C52 U4

### Ports
3.3V_ON (out, see Digital_IO[1C]), 20V_ON (out, see Digital_IO[1C]), DRIVER_EN (out, see MCU.chDoc[3A]), MD1_DIR (out, see Motordrivers[1A]), MD1_EN (out, see Motordrivers[1A]), MD1_Err_Detect (in, see Motordrivers[1A]), MD1_Step (out, see Motordrivers[1A]), MD1_Step_Index (in, see Motordrivers[1A]), MD1_UART (bidir, see Motordrivers[1A]), MD2_DIR (out, see Motordrivers[1C]), MD2_EN (out, see Motordrivers[1B]), MD2_Err_Detect (in, see Motordrivers[1C]), MD2_STEP (out, see Motordrivers[1C]), MD2_Step_Index (in, see Motordrivers[1C]), MD2_UART (bidir, see Motordrivers[1C]), MD_UART (bidir, see MCU.chDoc[3A]), PD_Alert (in, see Digital_IO[3B]), PD_SCL (out, see Digital_IO[3B]), PD_SDA (bidir, see Digital_IO[3B]), SPI_CS (in, see MCU.chDoc[1A]), SPI_CS (out, see MCU.chDoc[1C]), SPI_MISO (in, see MCU.chDoc[1C]), SPI_MISO (out, see MCU.chDoc[1A]), SPI_MOSI (in, see MCU.chDoc[1A]), SPI_MOSI (out, see MCU.chDoc[1C]), SPI_READY (in, see MCU.chDoc[3B]), SPI_READY (out, see MCU.chDoc[1C]), SPI_SCK (in, see MCU.chDoc[1A]), SPI_SCK (out, see MCU.chDoc[1C]), SWCLK (bidir, see Digital_IO[2D]), SWDIO (bidir, see Digital_IO[2C]), SWO (bidir, see Digital_IO[3D]), USBD_N (bidir, see Digital_IO[1B]), USBD_P (bidir, see Digital_IO[1A]), WIFI_BOOT (in, see MCU.chDoc[1A]), WIFI_BOOT (out, see MCU.chDoc[1C]), WIFI_ENABLE (in, see MCU.chDoc[3B]), WIFI_ENABLE (out, see MCU.chDoc[1C]), WIFI_RX (in, see MCU.chDoc[1A]), WIFI_RX (out, see MCU.chDoc[1C]), WIFI_TX (in, see MCU.chDoc[1C]), WIFI_TX (out, see MCU.chDoc[1A])

### Nets
3.3V: C27.2 C28.2 C33.2 C50.2 C51.2 C52.2 R30.2 R31.2 R32.2 R33.2 U4.9(VDDIO) U4.16(VDD33) U4.25(VDDIO)
GND: C27.1 C28.1 C33.1 C50.1 C51.1 C52.1 R15.2 R16.2 U4.10(GND) U4.15(GND) U4.18(GND) U4.26(GND) U4.30(GND) U4.32(GND) U4.33(GND) U4.34(GND) U4.35(GND) U4.36(GND)
3.3V_ON: B1.27(PB1) ; port 3.3V_ON
20V_ON: B1.26(PB0) ; port 20V_ON
DRIVER_EN: B1.37(PB15) R30.1 ; port MD1_EN, port MD2_EN, port DRIVER_EN
MD1_DIR: B1.43(PC9) ; port MD1_Step
MD1_ERR_Detect: B1.46(PA10) ; port MD1_Err_Detect
MD1_STEP: B1.42(PC8) ; port MD1_DIR
MD1_STEP_Index: B1.45(PA9) ; port MD1_Step_Index
MD2_DIR: B1.38(PD11) ; port MD2_DIR
MD2_ERR_Detect: B1.41(PC7) ; port MD2_Err_Detect
MD2_STEP: B1.39(PD12) ; port MD2_STEP
MD2_STEP_Index: B1.40(PC6) ; port MD2_Step_Index
MD_UART: B1.35(PB13) ; port MD1_UART, port MD2_UART, port MD_UART
PD_Alert: B1.59(PB5) R31.1 ; port PD_Alert
PD_SCL: B1.60(PB6) R32.1 ; port PD_SCL
PD_SDA: B1.61(PB7) R33.1 ; port PD_SDA
SPI_CS: B1.20(PA4) U4.24(SPI_CS) ; port SPI_CS
SPI_MISO: B1.23(PA7) U4.29(SPI_MISO) ; port SPI_MISO
SPI_MOSI: B1.22(PA6) U4.27(SPI_MOSI) ; port SPI_MOSI
SPI_READY: B1.55(PC11) U4.21(SPI_RDY) ; port SPI_READY
SPI_SCK: B1.21(PA5) U4.28(SPI_CLK) ; port SPI_SCK
SWCLK: B1.52(PA14) ; port SWCLK
SWDIO: B1.49(PA13) ; port SWDIO
SWO: B1.57(PB3) ; port SWO
USBD_N: B1.47(PA11) ; port USBD_N
USBD_P: B1.48(PA12) ; port USBD_P
WIFI_BOOT: B1.17(PA3) R16.1 U4.3(BOOT) ; port WIFI_BOOT
WIFI_ENABLE: B1.56(PC12) R15.1 U4.17(CHIP_EN) ; port WIFI_ENABLE
WIFI_RX: B1.14(PA0) U4.23(UART_RX) ; port WIFI_RX
WIFI_TX: B1.15(PA1) U4.22(UART_TX) ; port WIFI_TX

Not connected (* = marked no-connect by the designer): B1 2(PC13) 8(PC0) 9(PC1) 10(PC2) 11(PC3) 16(PA2) 24(PC4) 25(PC5) 28(PB2) 29(PB10) 30(PB11) 34(PB12) 36(PB14) 44(PA8) 53(PA15) 54(PC10) 58(PB4) 63(PB8) 64(PB9) 65(PE0); U4 1(RESERVED)* 2(RESERVED)* 4(RESERVED)* 5(RESERVED)* 6(RESERVED)* 7(RESERVED)* 8(RESERVED)* 11(RESERVED)* 12(RESERVED)* 13(XTAL32K_OUT)* 14(XTAL32K_IN)* 19(RESERVED)* 20(RESERVED)* 31(NC)*

### Layout directives
mark named 90ohm: USBD_N, USBD_P
differential pair: USBD_N, USBD_P

### Notes on the sheet
- (near B1) UART4_TX
- (near B1) UART4_RX
- Shared Driver UART Line
- (near B1) IO
- (near B1) SPI1_NSS
- (near B1) SPI1_SCK
- (near B1) SPI1_MISO
- (near B1) Uart5_TX
- Half-Duplex, Open Drain
- (near B1) EXTI9
- (near B1) SPI1_MOSI
- (near B1) USBDM
- (near B1) EXTI10
- (near R30) Enable Bootstrap
- (near B1) USBDP
- (near B1) EXTI6
- (near B1) EXTI7
- (near B1) EXTI11
- (near R15) Bootstrap Default Pulldowns
- (near R31) I2C Pullups (PUT CLOSE TO B1!)
- (near B1) EXTI5
- (near B1) I2C1_SCL
- (near B1) I2C1_SDA
- Pin16 Decoupling
- Pin9 Decoupling
- Pin25 Decoupling
- Title
- Engineer
- Size:
- Date:
- A4
- Number:
- Time:
- Revision:
- Sheet
- of
- File:

### Library data of the parts
B1 = CMP-004-000001-1: as B1 on sheet PowerRails; Datasheet Link: https://www.st.com/resource/en/datasheet/stm32h562ag.pdf; Mouser Price/Stock: https://www.mouser.co.uk/ProductDetail/STMicroelectronics/STM32H563RGV6?qs=Jm2GQyTW%2FbjkEO3Um3%252BxKg%3D%3D; Mouser Part Number: 511-STM32H563RGV6; Design Item ID: STM32H563RGV6; Manufacturer_Part_Number: STM32H563RGV6; Source: STM32H563RGV6.SchLib; Memory Format: FLASH; REACH SVHC: Yes; Lifecycle Status: Production; Pins: 68; China RoHS: Compliant; RoHS: Compliant
C27 C33 C51 = CMP-001-00065-7: as C29 on sheet PowerRails; Mounting Technology: SMT; Case/Package: 0402; Pins: 2; Min Operating Temperature: -55°C; Max Operating Temperature: 85°C; Voltage Rating: 25V
C28 C50 C52 = CMP-001-00015-9: Chip Capacitor, 10 uF, +/- 10%, 16 V, 0805 (2012 Metric); Capacitor Type: Ceramic; Voltage Rating: 16V; Mounting Technology: SM; Case/Package: 0805; Pins: 2; RoHS Compliant: True; Min Operating Temperature: -55°C; Max Operating Temperature: 85°C; Tolerance: 10%
R15 R16 = Resistors: Resistor, Pulldown; Case/Package: 0402; Component Type: Resistors
R30-R33 = Resistors: Resistor, Pullup; Case/Package: 0402; Component Type: Resistors
U4 = CMP-014-000001-5: 802.15.4, Bluetooth, WiFi 802.11b/g/n/ax, Bluetooth v5.4, Thread, ZigbeeÂ® Transceiver Module 2.4GHz PCB Trace Surface Mount; MF: STMicroelectronics; Package: None; Pin Count: 36; Component Type: Standard; Design Item ID: ST67W611M1A6BTR; Source: ST67W611M1A6BTR.SchLib; MP: ST67W611M1A6BTR; SnapEDA_Link: https://www.snapeda.com/parts/ST67W611M1A6BTR/STMicroelectronics/view-part/?ref=snap; Check_prices: https://www.snapeda.com/parts/ST67W611M1A6BTR/STMicroelectronics/view-part/?ref=eda; Value: *

## Nets that join several sheets
3.3V: Motordrivers (8 pins), PowerRails (14 pins), Digital_IO (J11.5), MCU.chDoc (13 pins)
GND: Motordrivers (44 pins), PowerRails (22 pins), Digital_IO (24 pins), MCU.chDoc (18 pins)
V_USB: Motordrivers (12 pins), PowerRails (C31.2 R13.1 U3.3), Digital_IO (R34.1)
V_USB_Isolated: PowerRails (TP2.1), Digital_IO (5 pins)
3.3V_ON: Digital_IO (D8.2), MCU.chDoc (B1.27)
20V_ON: Digital_IO (D7.2), MCU.chDoc (B1.26)
DRIVER_EN: Motordrivers (U1.2 U2.2), MCU.chDoc (B1.37 R30.1)
MD1_DIR: Motordrivers (U1.16), MCU.chDoc (B1.43)
MD1_ERR_Detect: Motordrivers (U1.11), MCU.chDoc (B1.46)
MD1_STEP: Motordrivers (U1.19), MCU.chDoc (B1.42)
MD1_STEP_Index: Motordrivers (U1.12), MCU.chDoc (B1.45)
MD2_DIR: Motordrivers (U2.19), MCU.chDoc (B1.38)
MD2_ERR_Detect: Motordrivers (U2.11), MCU.chDoc (B1.41)
MD2_STEP: Motordrivers (U2.16), MCU.chDoc (B1.39)
MD2_STEP_Index: Motordrivers (U2.12), MCU.chDoc (B1.40)
MD_UART: Motordrivers (U1.14 U2.14), MCU.chDoc (B1.35)
NetB1_7: PowerRails (B1.7), Digital_IO (J11.3)
PD_Alert: Digital_IO (U5.19), MCU.chDoc (B1.59 R31.1)
PD_SCL: Digital_IO (U5.7), MCU.chDoc (B1.60 R32.1)
PD_SDA: Digital_IO (U5.8), MCU.chDoc (B1.61 R33.1)
SWCLK: Digital_IO (J11.4), MCU.chDoc (B1.52)
SWDIO: Digital_IO (J11.6), MCU.chDoc (B1.49)
SWO: Digital_IO (J11.1), MCU.chDoc (B1.57)
USBD_N: Digital_IO (D5.1 J8.A7 J8.B7), MCU.chDoc (B1.47)
USBD_P: Digital_IO (D5.2 J8.A6 J8.B6), MCU.chDoc (B1.48)